# Altium project Air724UG_Reference Design_V1.0(PADS9.5).PrjPcb (part 2 of 3)

## Sheet SIM.SchDoc: Air724UG 参考设计
size 594 x 419 mm; DESIGNER: Loukanghua; REV: V1.0
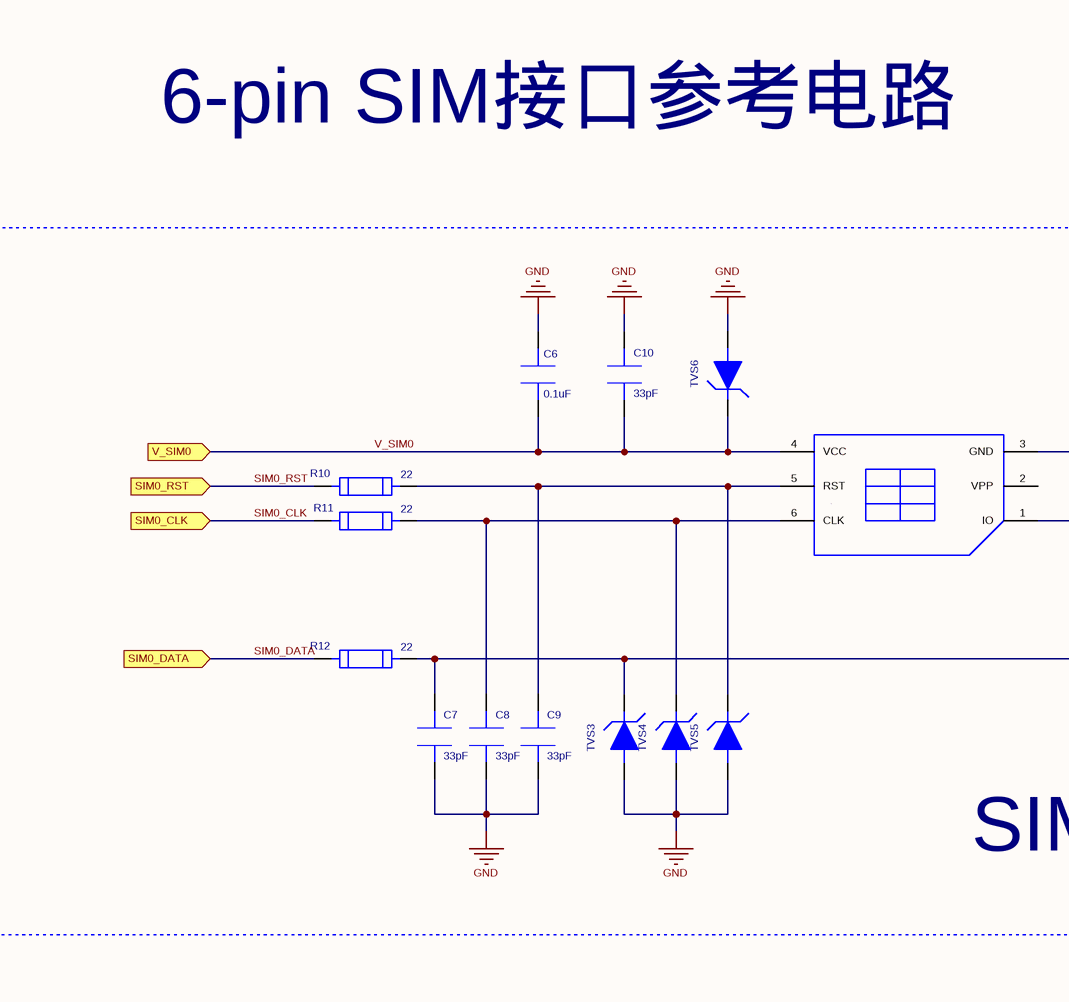
[diagram p23: SIM.SchDoc, top left]
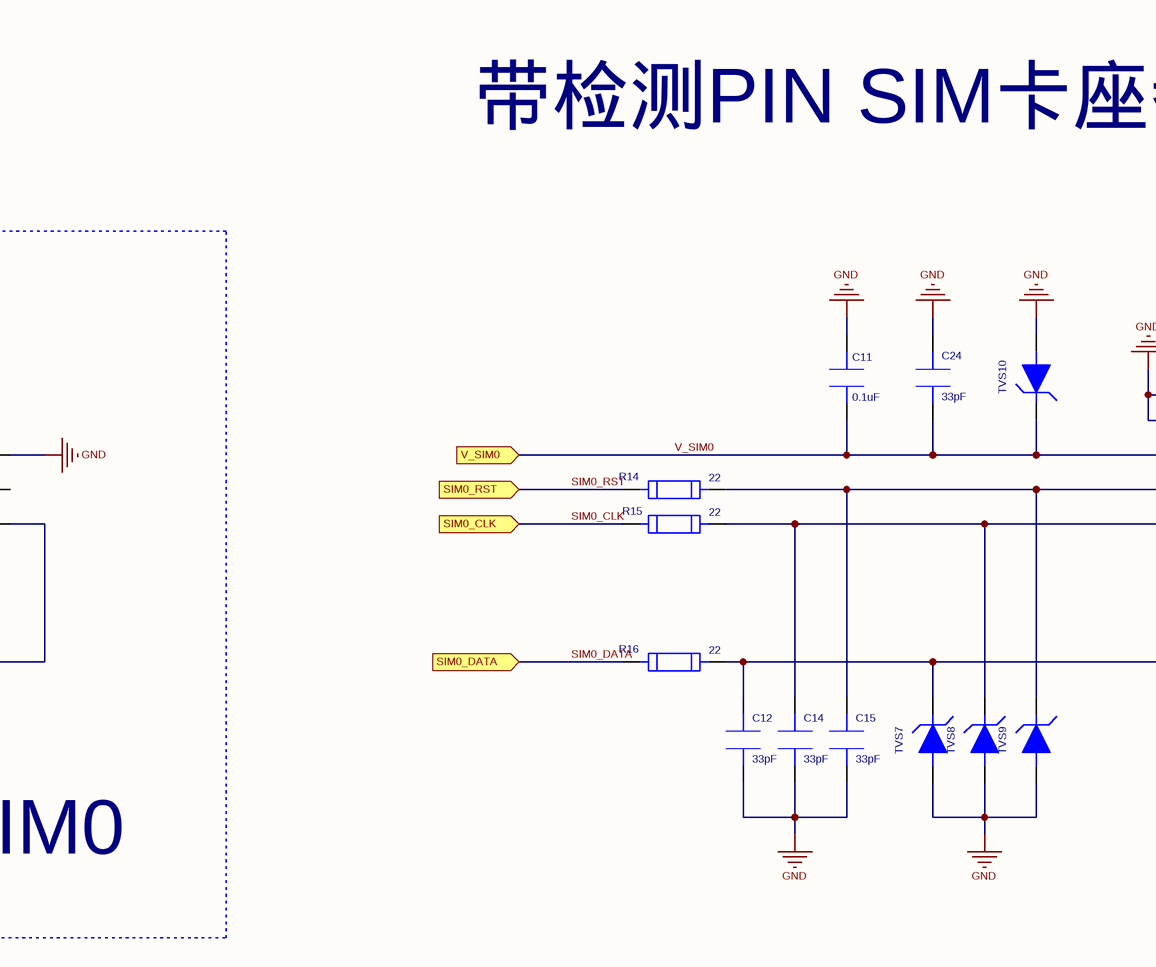
[diagram p24: SIM.SchDoc, top middle]
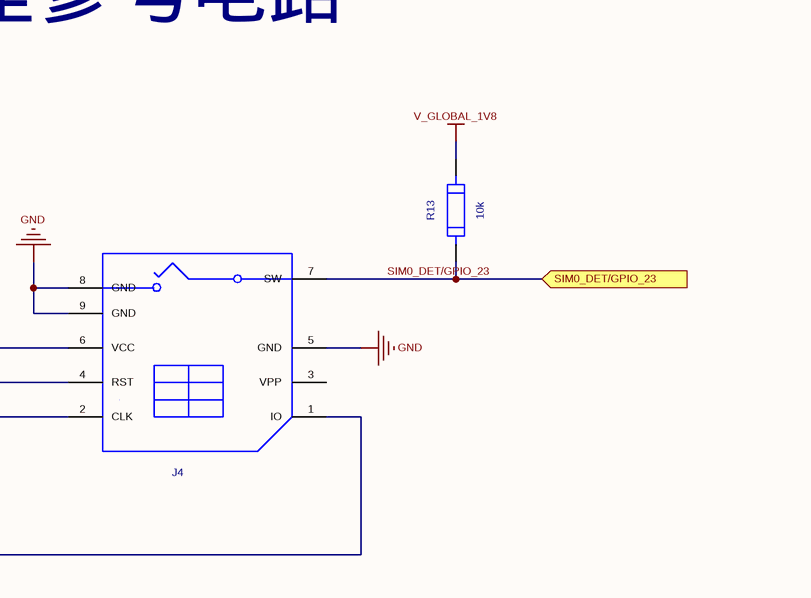
[diagram p25: SIM.SchDoc, top right]
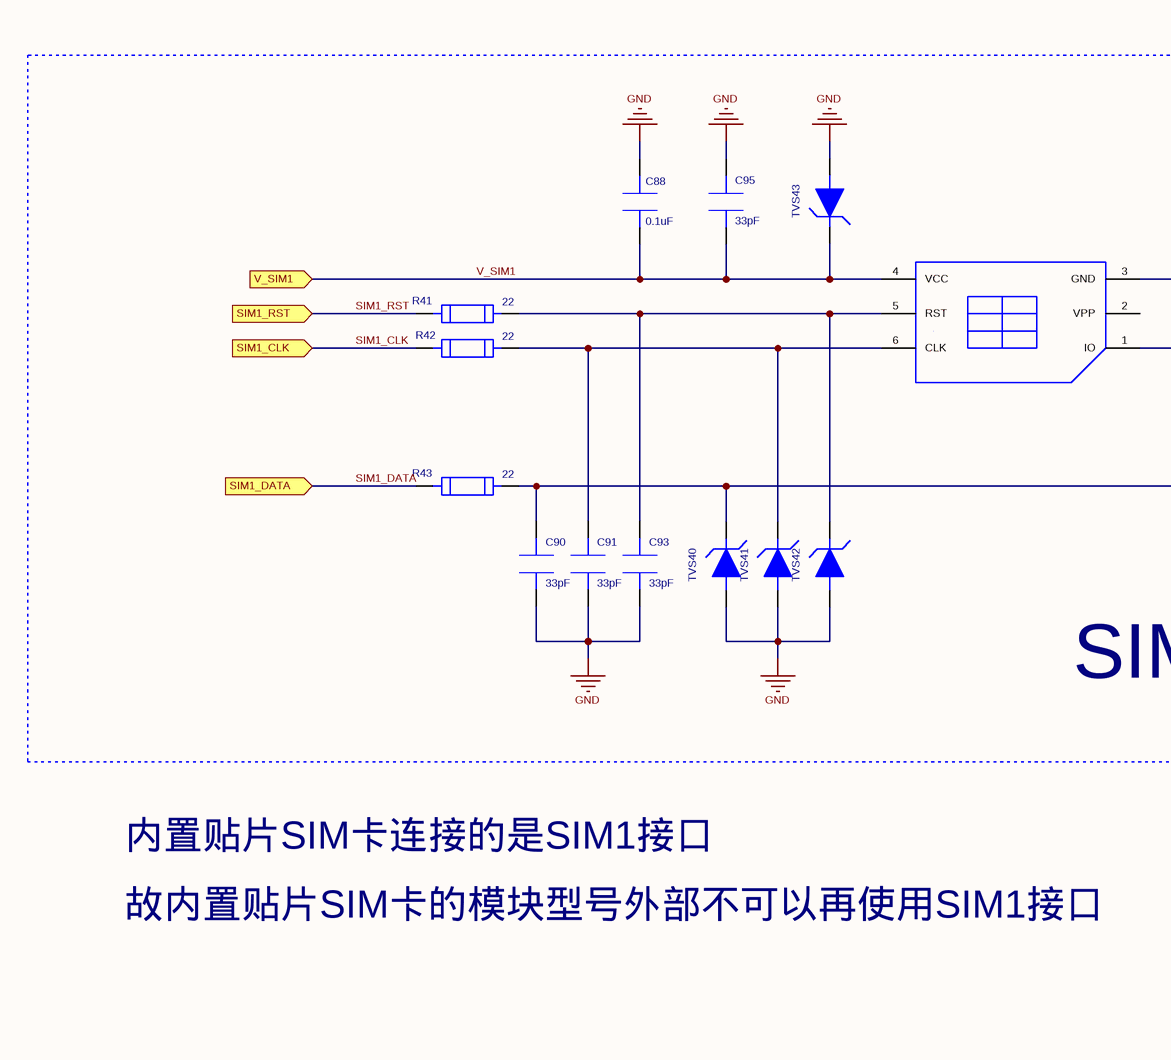
[diagram p26: SIM.SchDoc, bottom left]
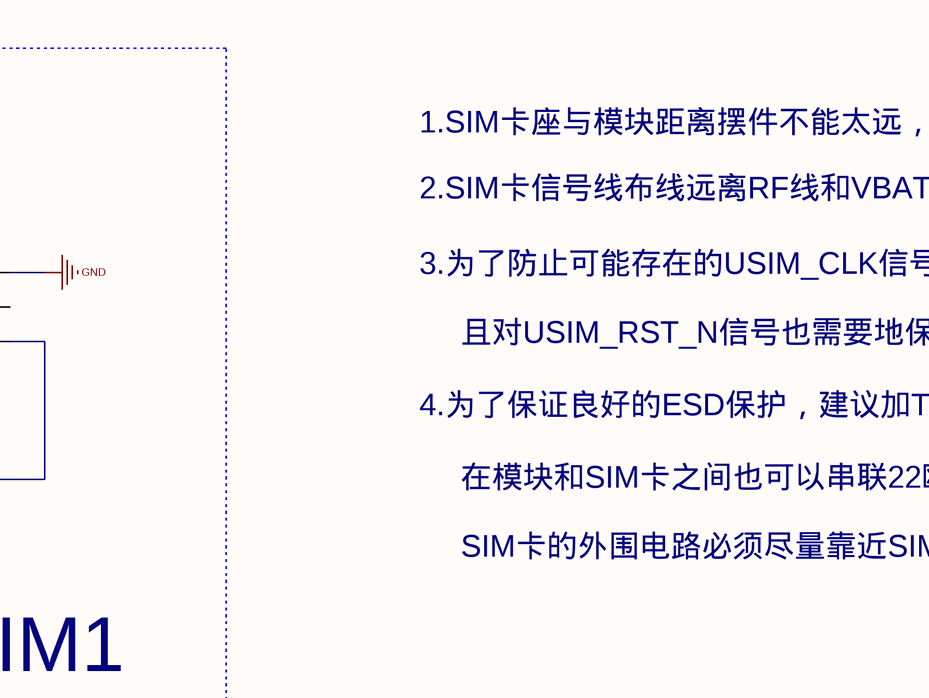
[diagram p27: SIM.SchDoc, bottom middle]
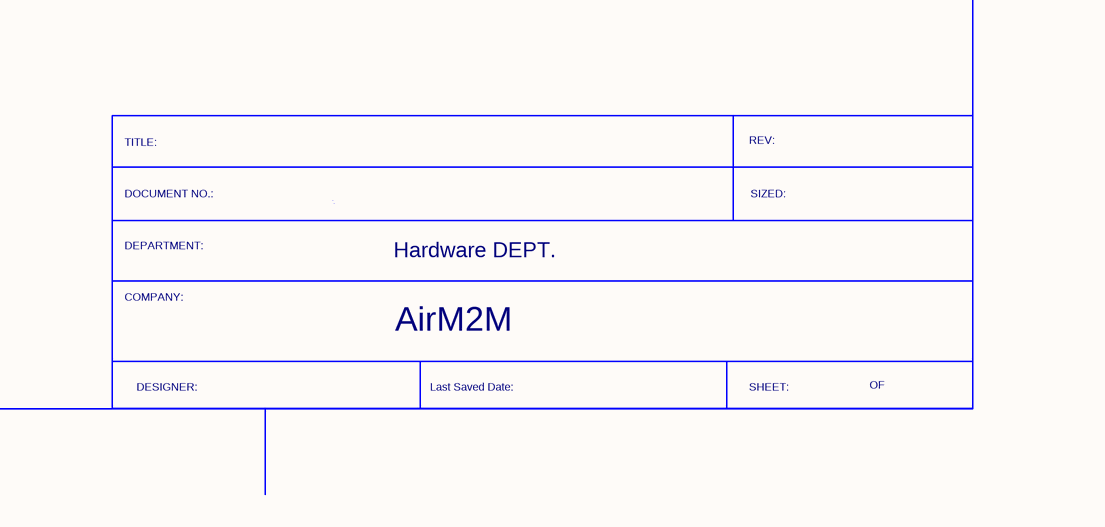
[diagram p28: SIM.SchDoc, bottom right]

### Parts
C6  value 0.1uF  [SC0402]  (hidden comment: CAP-0.1UF-0402-X5R-10V)
C7  value 33pF  [SC0402]  (hidden comment: CAP-33PF-0402-C0G)
C8  value 33pF  [SC0402]  (hidden comment: CAP-33PF-0402-C0G)
C9  value 33pF  [SC0402]  (hidden comment: CAP-33PF-0402-C0G)
C10  value 33pF  [SC0402]  (hidden comment: CAP-33PF-0402-C0G)
C11  value 0.1uF  [SC0402]  (hidden comment: CAP-0.1UF-0402-X5R-10V)
C12  value 33pF  [SC0402]  (hidden comment: CAP-33PF-0402-C0G)
C14  value 33pF  [SC0402]  (hidden comment: CAP-33PF-0402-C0G)
C15  value 33pF  [SC0402]  (hidden comment: CAP-33PF-0402-C0G)
C24  value 33pF  [SC0402]  (hidden comment: CAP-33PF-0402-C0G)
C88  value 0.1uF  [SC0402]  (hidden comment: CAP-0.1UF-0402-X5R-10V)
C90  value 33pF  [SC0402]  (hidden comment: CAP-33PF-0402-C0G)
C91  value 33pF  [SC0402]  (hidden comment: CAP-33PF-0402-C0G)
C93  value 33pF  [SC0402]  (hidden comment: CAP-33PF-0402-C0G)
C95  value 33pF  [SC0402]  (hidden comment: CAP-33PF-0402-C0G)
J2  SIMCARD6_1  [SIMCARD6]  (value not drawn)
J4  SIM-SW-CAF98-06206-XX00  [SIM-SW-CAF98-06206-XX00]  (value not drawn)
J10  SIMCARD6_1  [SIMCARD6]  (value not drawn)
R10  value 22  [SR0402]  (hidden comment: RES-22-0402)
R11  value 22  [SR0402]  (hidden comment: RES-22-0402)
R12  value 22  [SR0402]  (hidden comment: RES-22-0402)
R13  value 10k  [SR0402]  (hidden comment: RES-10K-0402)
R14  value 22  [SR0402]  (hidden comment: RES-22-0402)
R15  value 22  [SR0402]  (hidden comment: RES-22-0402)
R16  value 22  [SR0402]  (hidden comment: RES-22-0402)
R41  value 22  [SR0402]  (hidden comment: RES-22-0402)
R42  value 22  [SR0402]  (hidden comment: RES-22-0402)
R43  value 22  [SR0402]  (hidden comment: RES-22-0402)
TVS3  ESD-TVS-ESD9X5.0ST5G  [SOD-923-ESD9X5.0ST5G]  (value not drawn)
TVS4  ESD-TVS-ESD9X5.0ST5G  [SOD-923-ESD9X5.0ST5G]  (value not drawn)
TVS5  ESD-TVS-ESD9X5.0ST5G  [SOD-923-ESD9X5.0ST5G]  (value not drawn)
TVS6  ESD-TVS-ESD9X5.0ST5G  [SOD-923-ESD9X5.0ST5G]  (value not drawn)
TVS7  ESD-TVS-ESD9X5.0ST5G  [SOD-923-ESD9X5.0ST5G]  (value not drawn)
TVS8  ESD-TVS-ESD9X5.0ST5G  [SOD-923-ESD9X5.0ST5G]  (value not drawn)
TVS9  ESD-TVS-ESD9X5.0ST5G  [SOD-923-ESD9X5.0ST5G]  (value not drawn)
TVS10  ESD-TVS-ESD9X5.0ST5G  [SOD-923-ESD9X5.0ST5G]  (value not drawn)
TVS40  ESD-TVS-ESD9X5.0ST5G  [SOD-923-ESD9X5.0ST5G]  (value not drawn)
TVS41  ESD-TVS-ESD9X5.0ST5G  [SOD-923-ESD9X5.0ST5G]  (value not drawn)
TVS42  ESD-TVS-ESD9X5.0ST5G  [SOD-923-ESD9X5.0ST5G]  (value not drawn)
TVS43  ESD-TVS-ESD9X5.0ST5G  [SOD-923-ESD9X5.0ST5G]  (value not drawn)

### Blocks framed on the sheet
SIM0: C6-C10 J2 R10-R12 TVS3-TVS6
SIM1: C88 C90 C91 C93 C95 J10 R41-R43 TVS40-TVS43

### Ports
SIM0_CLK, SIM0_DATA, SIM0_DET/GPIO_23, SIM0_RST, SIM1_CLK, SIM1_DATA, SIM1_RST, V_SIM0, V_SIM1

### Nets
GND: C6.2 C7.2 C8.2 C9.2 C10.1 C11.2 C12.2 C14.2 C15.2 C24.1 C88.2 C90.2 C91.2 C93.2 C95.1 J2.3(GND) J4.5(GND) J4.8(GND) J4.9(GND) J10.3(GND) TVS3.2 TVS4.2 TVS5.2 TVS6.2 TVS7.2 TVS8.2 TVS9.2 TVS10.2 TVS40.2 TVS41.2 TVS42.2 TVS43.2
V_GLOBAL_1V8: R13.2
SIM0_CLK: R11.1 R15.1 ; port SIM0_CLK
SIM0_DATA: R12.1 R16.1 ; port SIM0_DATA
SIM0_DET/GPIO_23: J4.7(SW) R13.1 ; port SIM0_DET/GPIO_23
SIM0_RST: R10.1 R14.1 ; port SIM0_RST
SIM1_CLK: R42.1 ; port SIM1_CLK
SIM1_DATA: R43.1 ; port SIM1_DATA
SIM1_RST: R41.1 ; port SIM1_RST
V_SIM0: C6.1 C10.2 C11.1 C24.2 J2.4(VCC) J4.6(VCC) TVS6.1 TVS10.1 ; port V_SIM0
V_SIM1: C88.1 C95.2 J10.4(VCC) TVS43.1 ; port V_SIM1
NetC7_1: C7.1 J2.1(IO) R12.2 TVS3.1
NetC8_1: C8.1 J2.6(CLK) R11.2 TVS4.1
NetC9_1: C9.1 J2.5(RST) R10.2 TVS5.1
NetC12_1: C12.1 J4.1(IO) R16.2 TVS7.1
NetC14_1: C14.1 J4.2(CLK) R15.2 TVS8.1
NetC15_1: C15.1 J4.4(RST) R14.2 TVS9.1
NetC90_1: C90.1 J10.1(IO) R43.2 TVS40.1
NetC91_1: C91.1 J10.6(CLK) R42.2 TVS41.1
NetC93_1: C93.1 J10.5(RST) R41.2 TVS42.1

Not connected (* = marked no-connect by the designer): J2 2(VPP); J4 3(VPP); J10 2(VPP)

### Notes on the sheet
- 6-pin SIM接口参考电路
- 带检测PIN SIM卡座参考电路
- 1.SIM卡座与模块距离摆件不能太远，越近越好，尽量保证SIM卡信号线布线不超过20cm；
- 2.SIM卡信号线布线远离RF线和VBAT电源线；
- 3.为了防止可能存在的USIM_CLK信号对USIM_DATA信号的串扰，两者布线不要太靠近，在两条走线之间增加地屏蔽。
- 且对USIM_RST_N信号也需要地保护;
- 4.为了保证良好的ESD保护，建议加TVS管，并靠近SIM卡座摆放。选择的ESD器件寄生电容不大于50pF。
- 在模块和SIM卡之间也可以串联22欧姆的电阻用以抑制杂散EMI，增强ESD防护。
- SIM卡的外围电路必须尽量靠近SIM卡座。
- 内置贴片SIM卡连接的是SIM1接口
- 故内置贴片SIM卡的模块型号外部不可以再使用SIM1接口
- TITLE:
- REV:
- DEPARTMENT:
- DOCUMENT NO.:
- Hardware DEPT.
- SIZED:
- COMPANY:
- AirM2M
- DESIGNER:
- Last Saved Date:
- SHEET:
- OF

### Library data of the parts
C6 C11 C88 = CAP-0.1UF-0402-X5R-10V: CAP CER X5R/X7R;0.1uF;+/-10%;10V;0402;0.5mm;ROHS; Manufacture 1: Murata;Yageo;Walsin;Eyang; Manufacture 1 P/N: GRM155R61A104K****;GRM155R71A104K****;CC0402KRX5R6BB104;0402X104K100CT;C0402X5R104K100N*; Geometry.Height: 0.55mm; Serial Number: 80214720001; Tolerance: +/-10%; PCB DECAL: SC0402
C7-C10 C12 C14 C15 C24 C90 C91 C93 C95 = CAP-33PF-0402-C0G: CAP CER C0G;33PF;+/-5%;50V;0402;0.5mm;ROHS; Manufacture 1: MURATA;Yageo;Eyang; Manufacture 1 P/N: GRM1555C1H330J****;CC0402JRNPO9BN330;C0402C0G330J500N*; Geometry.Height: 0.55mm; Serial Number: 80214650008; Tolerance: +/-5%; PCB DECAL: SC0402
J2 J10 = SIMCARD6_1: SIM?座;6PIN;17.70*8.30*3.60mm;ROHS; Manufacture 1: 皇泽;; Manufacture 1 P/N: SIMWH-03605-TP00; Serial Number: 81300000026; Geometry.Height: 3.6mm; PCB DECAL: SIMCARD6
J4 = SIM-SW-CAF98-06206-XX00: SIM卡座;8PIN;PUSH TO PUSH;26.6*19.1*2.1mm;ROHS; Manufacture 1 P/N: CAF98-06206-S100; Manufacture 1: 乾德电子(Linkconn);; Geometry.Height: 2.1mm; Serial Number: 81330000088; PCB DECAL: SIM-SW-CAF98-06206-XX00
R10-R12 R14-R16 R41-R43 = RES-22-0402: RES FILM;22;+/-5%;1/16W;0402;0.4mm;ROHS; Manufacture 1 P/N: RC0402JR-0722RL; Manufacture 1: YAGEO; Serial Number: 80114640035; Geometry.Height: 0.4mm; Tolerance: +/-5%; PCB DECAL: SR0402
R13 = RES-10K-0402: RES FILM;10K;+/-5%;1/16W;0402;0.4mm;ROHS; Manufacture 1 P/N: RC0402JR-0710KL;WR04X103_JTL; Manufacture 1: YAGEO;Walsin; Serial Number: 80114640004; Geometry.Height: 0.4mm; Tolerance: +/-5%; PCB DECAL: SR0402
TVS3-TVS10 TVS40-TVS43 = ESD-TVS-ESD9X5.0ST5G: TVS;5.0V;65PF;SOD?923;ROHS; Manufacture 1: ONSEMI; Geometry.Height: 0.43mm; Serial Number: 81121000001; Manufacture 1 P/N: ESD9X5.0ST5G; PCB DECAL: SOD-923-ESD9X5.0ST5G

## Sheet T-FLASH.SchDoc: Air724UG 参考设计
size 594 x 419 mm; DESIGNER: Loukanghua; REV: V1.0
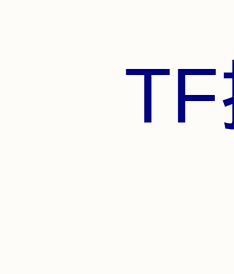
[diagram p29: T-FLASH.SchDoc, top left]
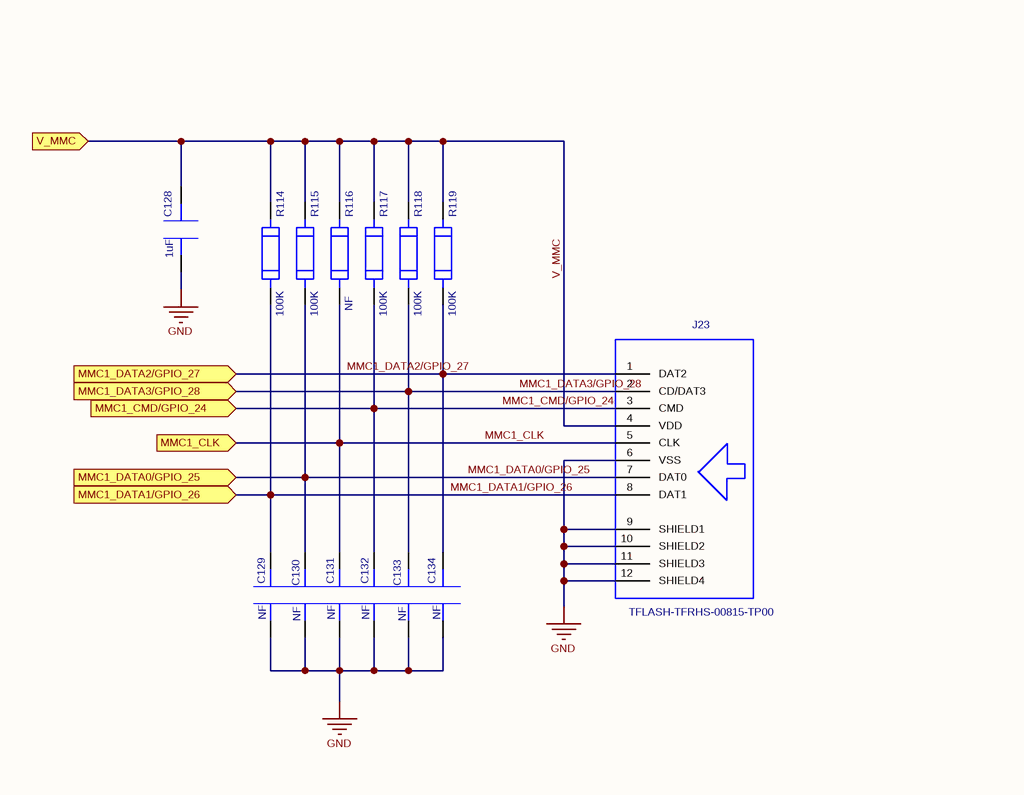
[diagram p30: T-FLASH.SchDoc, top middle]
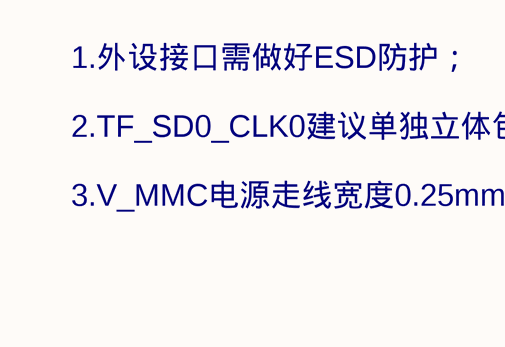
[diagram p31: T-FLASH.SchDoc, bottom middle]
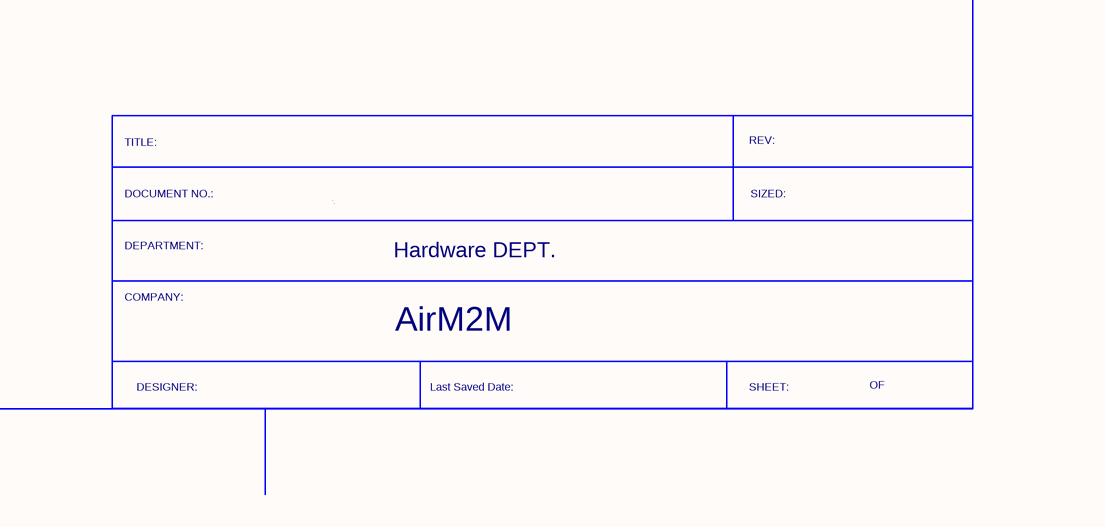
[diagram p32: T-FLASH.SchDoc, bottom right]

### Parts
C128  value 1uF  [SC0402]  (hidden comment: CAP-1UF-0402-X5R)
C129  value NF  [SC0402-NF]  (hidden comment: CAP-0402-NF)
C130  value NF  [SC0402-NF]  (hidden comment: CAP-0402-NF)
C131  value NF  [SC0402-NF]  (hidden comment: CAP-0402-NF)
C132  value NF  [SC0402-NF]  (hidden comment: CAP-0402-NF)
C133  value NF  [SC0402-NF]  (hidden comment: CAP-0402-NF)
C134  value NF  [SC0402-NF]  (hidden comment: CAP-0402-NF)
J23  TFLASH-TFRHS-00815-TP00  [TFLASH-TFRHS-00815-TP00]
R114  value 100K  [SR0402]  (hidden comment: RES-100K-0402)
R115  value 100K  [SR0402]  (hidden comment: RES-100K-0402)
R116  value NF  [SR0402-NF]  (hidden comment: RES-0402-NF)
R117  value 100K  [SR0402]  (hidden comment: RES-100K-0402)
R118  value 100K  [SR0402]  (hidden comment: RES-100K-0402)
R119  value 100K  [SR0402]  (hidden comment: RES-100K-0402)

### Ports
MMC1_CLK, MMC1_CMD/GPIO_24, MMC1_DATA0/GPIO_25, MMC1_DATA1/GPIO_26, MMC1_DATA2/GPIO_27, MMC1_DATA3/GPIO_28, V_MMC

### Nets
GND: C128.2 C129.2 C130.2 C131.2 C132.2 C133.2 C134.2 J23.6(VSS) J23.9(SHIELD1) J23.10(SHIELD2) J23.11(SHIELD3) J23.12(SHIELD4)
MMC1_CLK: C131.1 J23.5(CLK) R116.1 ; port MMC1_CLK
MMC1_CMD/GPIO_24: C132.1 J23.3(CMD) R117.1 ; port MMC1_CMD/GPIO_24
MMC1_DATA0/GPIO_25: C130.1 J23.7(DAT0) R115.1 ; port MMC1_DATA0/GPIO_25
MMC1_DATA1/GPIO_26: C129.1 J23.8(DAT1) R114.1 ; port MMC1_DATA1/GPIO_26
MMC1_DATA2/GPIO_27: C134.1 J23.1(DAT2) R119.1 ; port MMC1_DATA2/GPIO_27
MMC1_DATA3/GPIO_28: C133.1 J23.2(CD/DAT3) R118.1 ; port MMC1_DATA3/GPIO_28
V_MMC: C128.1 J23.4(VDD) R114.2 R115.2 R116.2 R117.2 R118.2 R119.2 ; port V_MMC

### Notes on the sheet
- TF接口参考电路
- 1.外设接口需做好ESD防护；
- 2.TF_SD0_CLK0建议单独立体包地，其他信号线整组一起同层包地；
- 3.V_MMC电源走线宽度0.25mm以上。
- TITLE:
- REV:
- DEPARTMENT:
- DOCUMENT NO.:
- Hardware DEPT.
- SIZED:
- COMPANY:
- AirM2M
- DESIGNER:
- Last Saved Date:
- SHEET:
- OF

### Library data of the parts
C128 = CAP-1UF-0402-X5R: CAP CER X5R;1uF;+/-10%;6.3V;0402;0.5mm;ROHS; Manufacture 1 P/N: GRM155R60J105K****;CC0402KRX5R5BB105;C1005X5R0J105KT;JMK105BJ105KV-F;ECJ0EB0J105K;0402X105K6R3CT;CL05A105KQ5NNNC; Manufacture 1: Murata;Yageo;TDK;Taiyo Yuden;Panasonic;Walsin;Samsung; Serial Number: 80214710001; Geometry.Height: 0.55mm; Tolerance: +/-10%; PCB DECAL: SC0402
C129-C134 = CAP-0402-NF: NF; Geometry.Height: 0.55mm; Manufacture 1: NF; Manufacture 1 P/N: NF; Serial Number: NF; PCB DECAL: SC0402-NF
J23 = TFLASH-TFRHS-00815-TP00: T-FLASH卡座;8PIN;掀盖式;13.6*14.5*1.95mm;ROHS; Manufacture 1 P/N: CAH11-08193-SF01;TFRHS-00815-TP00;TFRHS-00815-XX00;AC0200-020;TF0108322-R;SG-TFS-0001; Manufacture 1: 乾德电子;皇泽;上海徕木;精塑;Singeen(星擎)();; serial number: TF0108522-R; Geometry.Height: 1.95mm; PCB DECAL: TFLASH-TFRHS-00815-TP00
R114 R115 R117-R119 = RES-100K-0402: RES FILM;100K;+/-5%;1/16W;0402;0.4mm;ROHS; Manufacture 1: YAGEO;Walsin; Manufacture 1 P/N: RC0402JR-07100KL;WR04X104_JTL;; Geometry.Height: 0.40mm; Serial Number: 80114640005; Tolerance: +/-5%; PCB DECAL: SR0402
R116 = RES-0402-NF: NF; Geometry.Height: 0.4mm; Tolerance: +/-5%; Serial Number: NF; Manufacture 1: NF; Manufacture 1 P/N: NF; PCB DECAL: SR0402-NF

## Sheet CAMERA.SchDoc: Air724UG 参考设计
size 594 x 419 mm; DESIGNER: Loukanghua; REV: V1.0
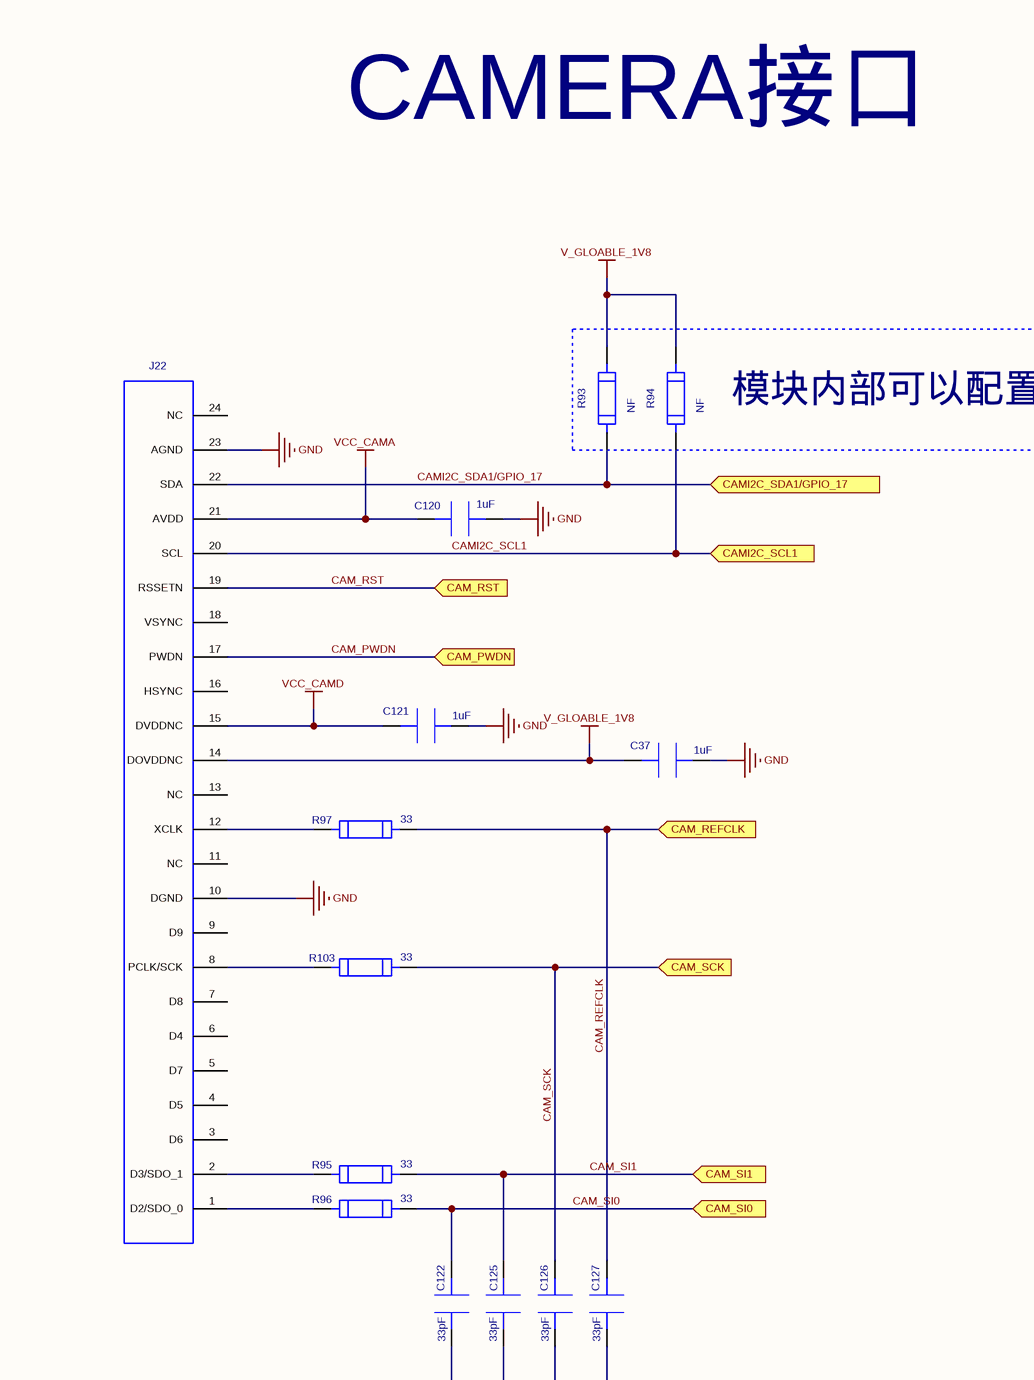
[diagram p33: CAMERA.SchDoc, top left]
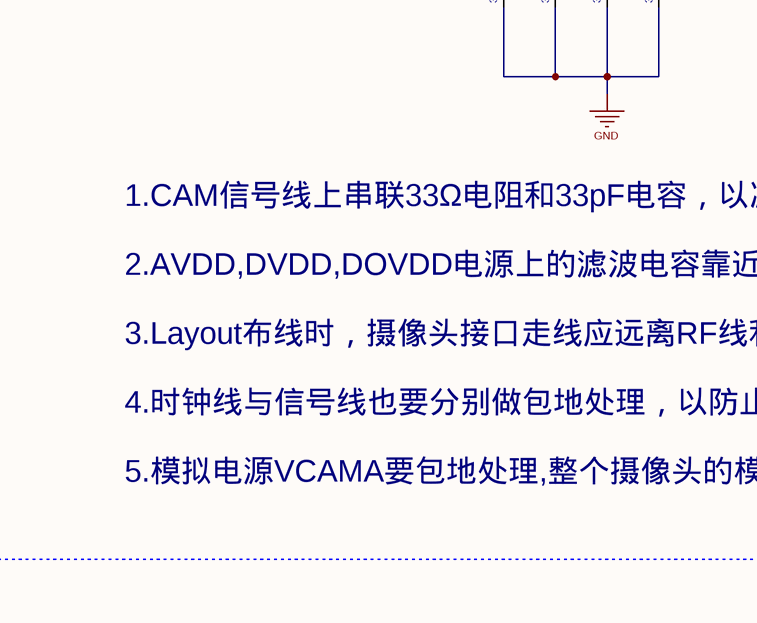
[diagram p34: CAMERA.SchDoc, bottom left]
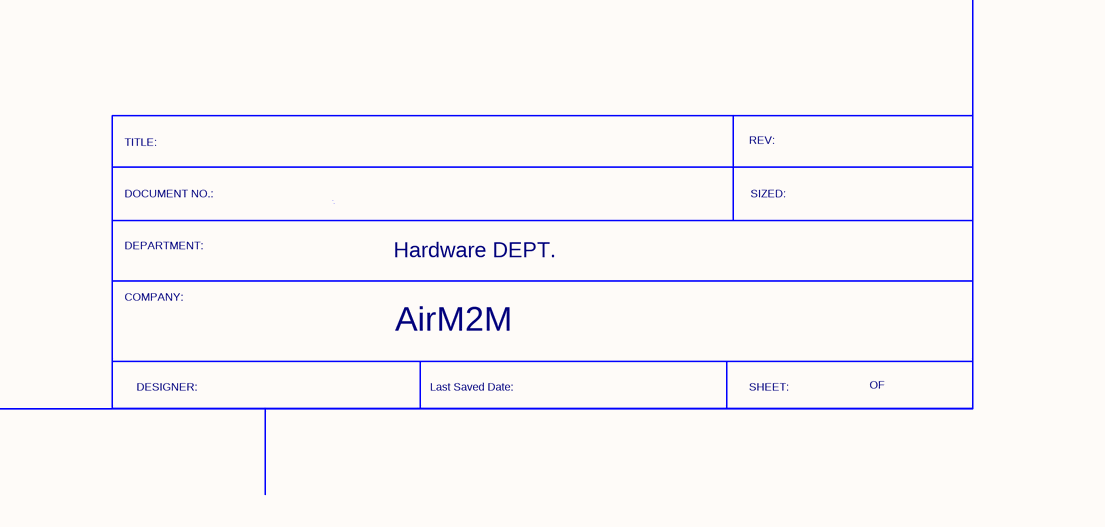
[diagram p35: CAMERA.SchDoc, bottom right]

### Parts
C37  value 1uF  [SC0402]  (hidden comment: CAP-1UF-0402-X5R)
C120  value 1uF  [SC0402]  (hidden comment: CAP-1UF-0402-X5R)
C121  value 1uF  [SC0402]  (hidden comment: CAP-1UF-0402-X5R)
C122  value 33pF  [SC0402]  (hidden comment: CAP-33PF-0402-C0G)
C125  value 33pF  [SC0402]  (hidden comment: CAP-33PF-0402-C0G)
C126  value 33pF  [SC0402]  (hidden comment: CAP-33PF-0402-C0G)
C127  value 33pF  [SC0402]  (hidden comment: CAP-33PF-0402-C0G)
J22  FPC-24PIN-0.5MM-Y  [FPC-24PIN-0.5MM]  (value not drawn)
R93  value NF  [SR0402-NF]  (hidden comment: RES-0402-NF)
R94  value NF  [SR0402-NF]  (hidden comment: RES-0402-NF)
R95  value 33  [SR0402]  (hidden comment: RES-22-0402)
R96  value 33  [SR0402]  (hidden comment: RES-22-0402)
R97  value 33  [SR0402]  (hidden comment: RES-22-0402)
R103  value 33  [SR0402]  (hidden comment: RES-22-0402)

### Blocks framed on the sheet
CAMERA接口: C37 C120-C122 C125-C127 J22 R95-R97 R103
模块内部可以配置I2C 上拉，外部可以不贴: R93 R94

### Ports
CAM_PWDN, CAM_REFCLK, CAM_RST, CAM_SCK, CAM_SI0, CAM_SI1, CAMI2C_SCL1, CAMI2C_SDA1/GPIO_17

### Nets
GND: C37.2 C120.1 C121.2 C122.1 C125.1 C126.1 C127.1 J22.10(DGND) J22.23(AGND) J22.25(GND) J22.26(GND)
V_GLOABLE_1V8: C37.1 J22.14(DOVDDNC) R93.2 R94.2
VCC_CAMA: C120.2 J22.21(AVDD)
VCC_CAMD: C121.1 J22.15(DVDDNC)
CAM_PWDN: J22.17(PWDN) ; port CAM_PWDN
CAM_REFCLK: C127.2 R97.2 ; port CAM_REFCLK
CAM_RST: J22.19(RSSETN) ; port CAM_RST
CAM_SCK: C126.2 R103.2 ; port CAM_SCK
CAM_SI0: C122.2 R96.2 ; port CAM_SI0
CAM_SI1: C125.2 R95.2 ; port CAM_SI1
CAMI2C_SCL1: J22.20(SCL) R94.1 ; port CAMI2C_SCL1
CAMI2C_SDA1/GPIO_17: J22.22(SDA) R93.1 ; port CAMI2C_SDA1/GPIO_17
NetJ22_1: J22.1(D2/SDO_0) R96.1
NetJ22_2: J22.2(D3/SDO_1) R95.1
NetJ22_8: J22.8(PCLK/SCK) R103.1
NetJ22_12: J22.12(XCLK) R97.1

Not connected (* = marked no-connect by the designer): J22 3(D6) 4(D5) 5(D7) 6(D4) 7(D8) 9(D9) 11(NC) 13(NC) 16(HSYNC) 18(VSYNC) 24(NC)

### Notes on the sheet
- 1.CAM信号线上串联33Ω电阻和33pF电容，以减小射频干扰。
- 2.AVDD,DVDD,DOVDD电源上的滤波电容靠近连接器端摆放。
- 3.Layout布线时，摄像头接口走线应远离RF线和VBAT电源线，尤其是时钟线与信号线。
- 4.时钟线与信号线也要分别做包地处理，以防止干扰。
- 5.模拟电源VCAMA要包地处理,整个摄像头的模拟部分是由VCAMA供电。
- TITLE:
- REV:
- DEPARTMENT:
- DOCUMENT NO.:
- Hardware DEPT.
- SIZED:
- COMPANY:
- AirM2M
- DESIGNER:
- Last Saved Date:
- SHEET:
- OF

### Library data of the parts
C37 C120 C121 = CAP-1UF-0402-X5R: as C128 on sheet T-FLASH; Tolerance: +/-10%; PCB DECAL: SC0402
C122 C125-C127 = CAP-33PF-0402-C0G: as C7-C10 on sheet SIM; Tolerance: +/-5%; PCB DECAL: SC0402
J22 = FPC-24PIN-0.5MM-Y: Geometry.Height: 2.0mm; PCB DECAL: FPC-24PIN-0.5MM
R93 R94 = RES-0402-NF: as R116 on sheet T-FLASH; Serial Number: NF; Manufacture 1 P/N: NF; Manufacture 1: NF; PCB DECAL: SR0402-NF
R95-R97 R103 = RES-22-0402: as R10 on sheet SIM; Geometry.Height: 0.4mm; Tolerance: +/-5%; PCB DECAL: SR0402

## Sheet UART.SchDoc: Air724UG 参考设计
size 594 x 419 mm; DESIGNER: Loukanghua; REV: V1.0
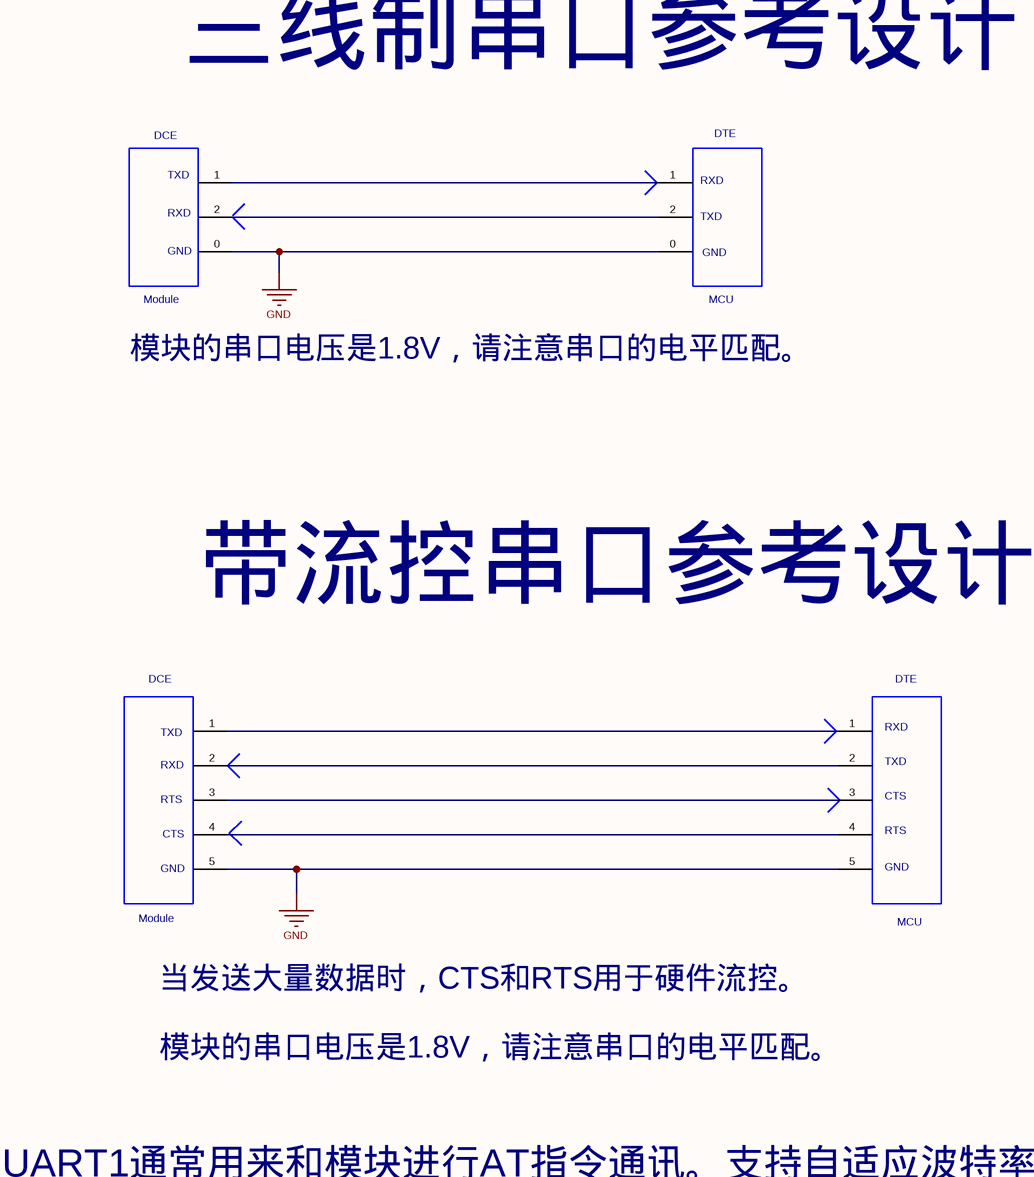
[diagram p36: UART.SchDoc, top left]
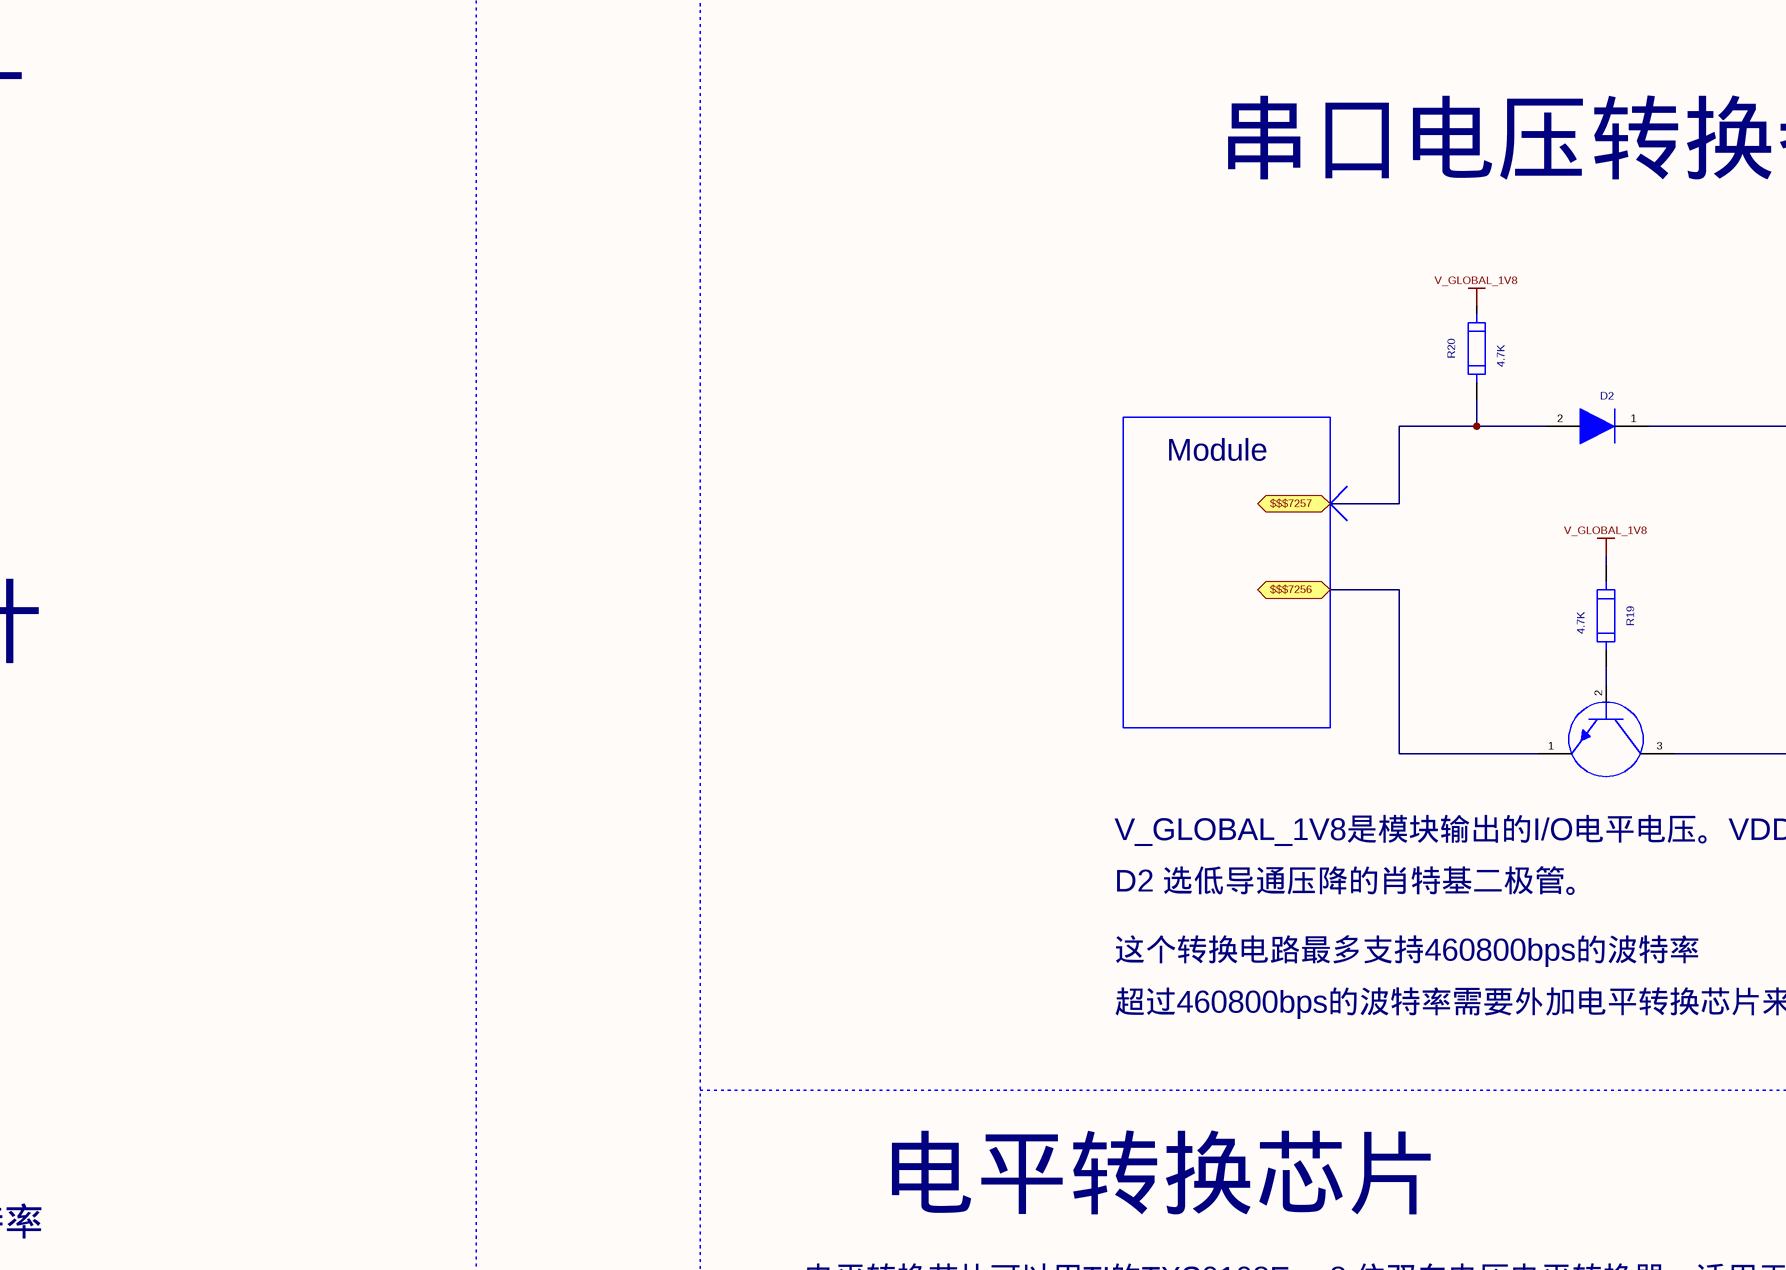
[diagram p37: UART.SchDoc, top middle]
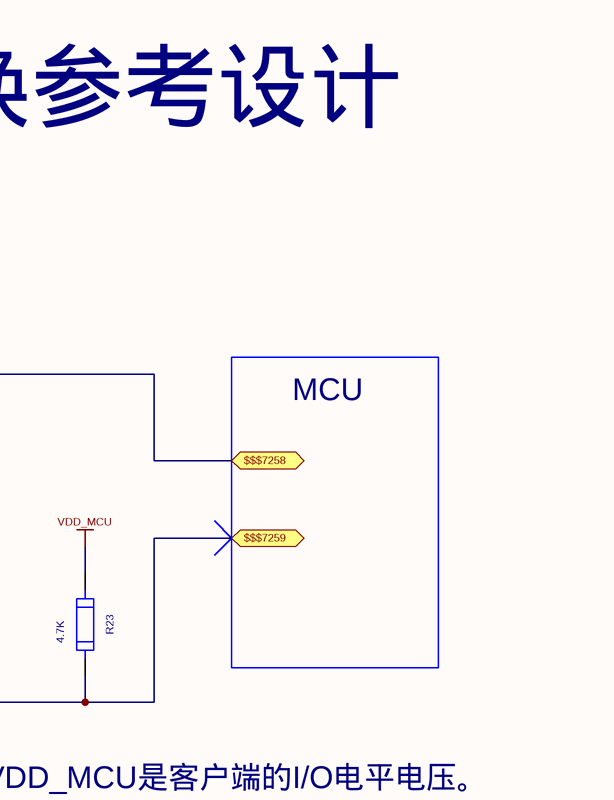
[diagram p38: UART.SchDoc, top right]
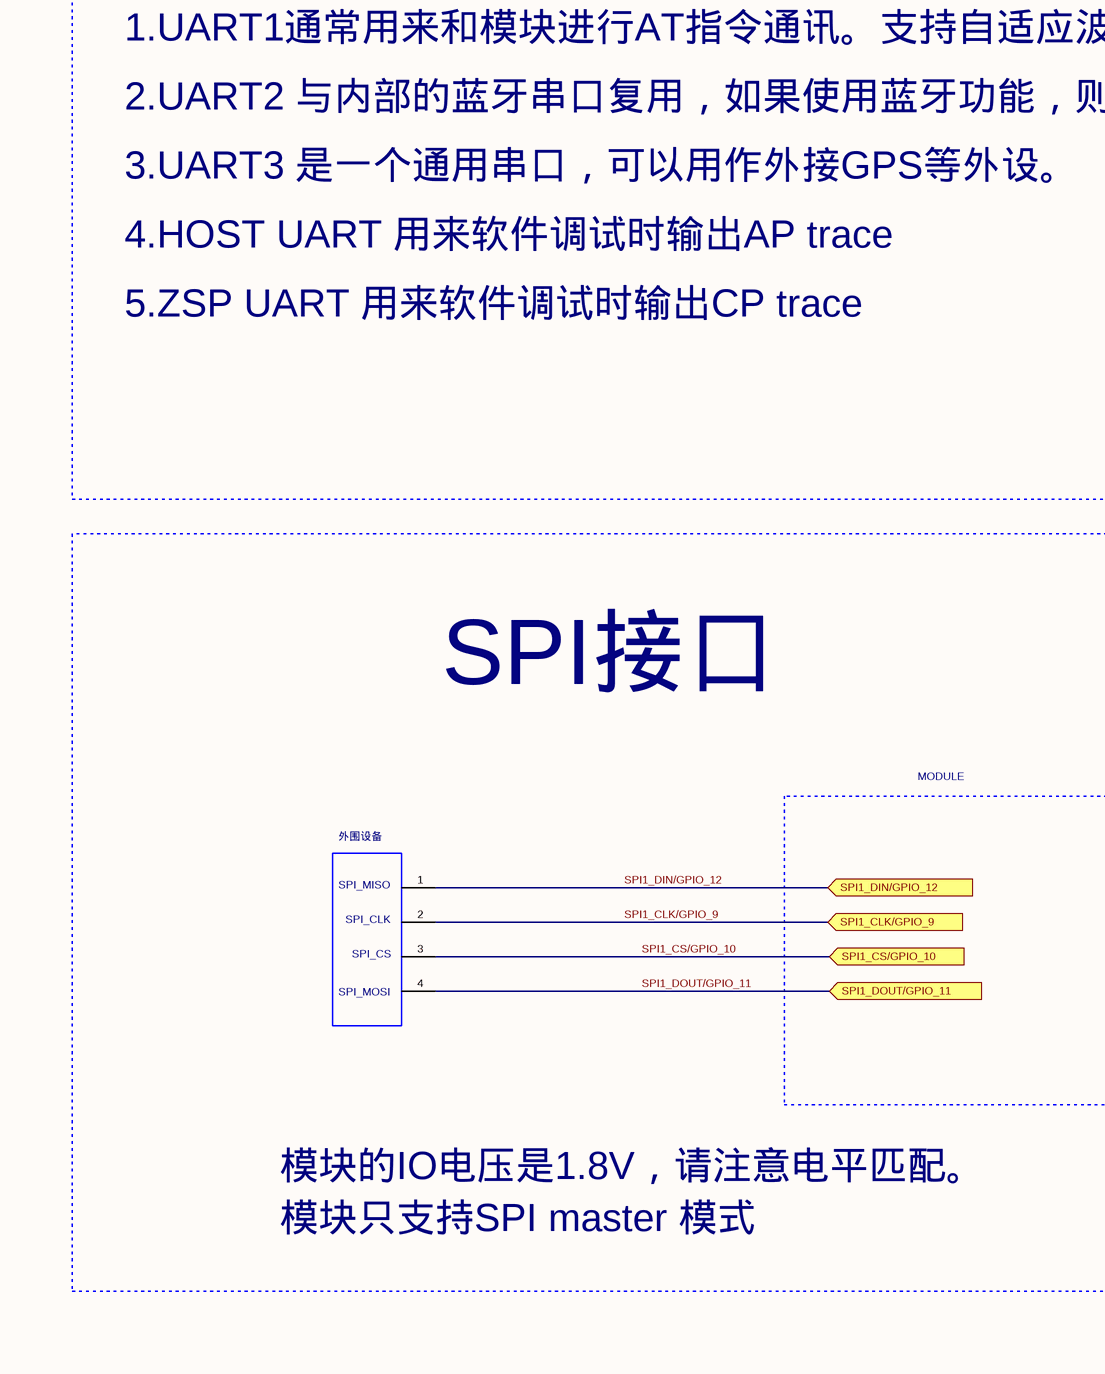
[diagram p39: UART.SchDoc, bottom left]
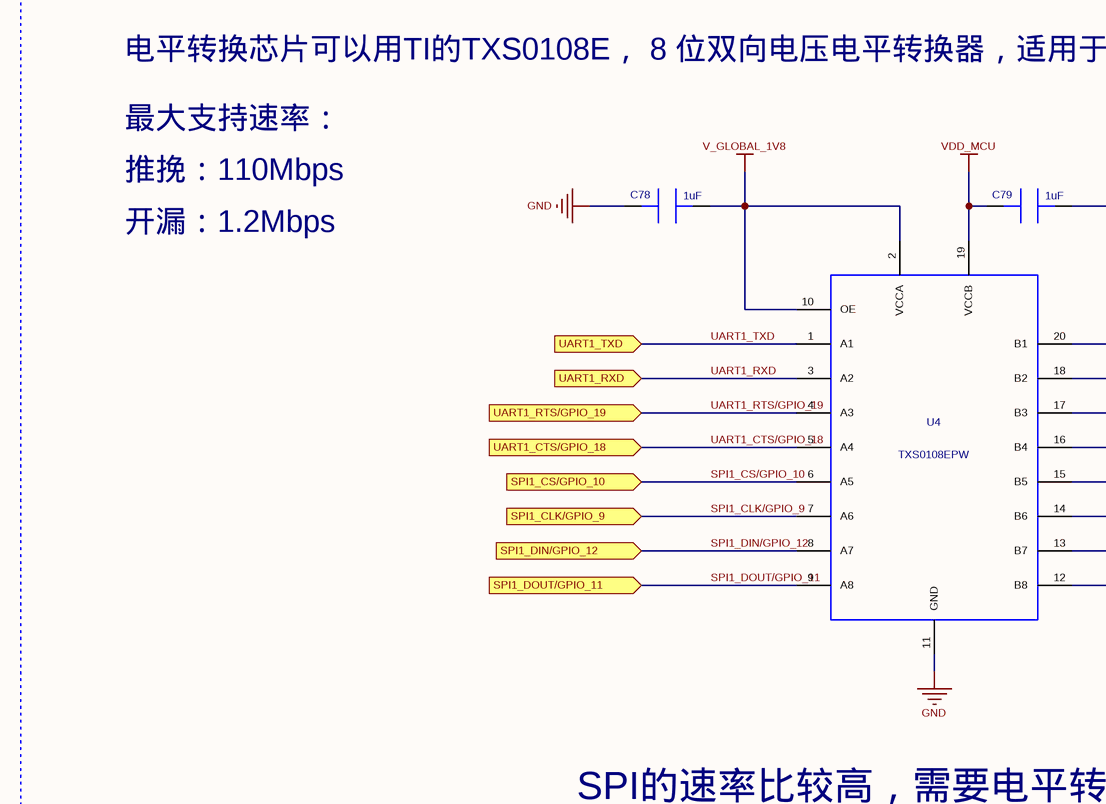
[diagram p40: UART.SchDoc, bottom middle]
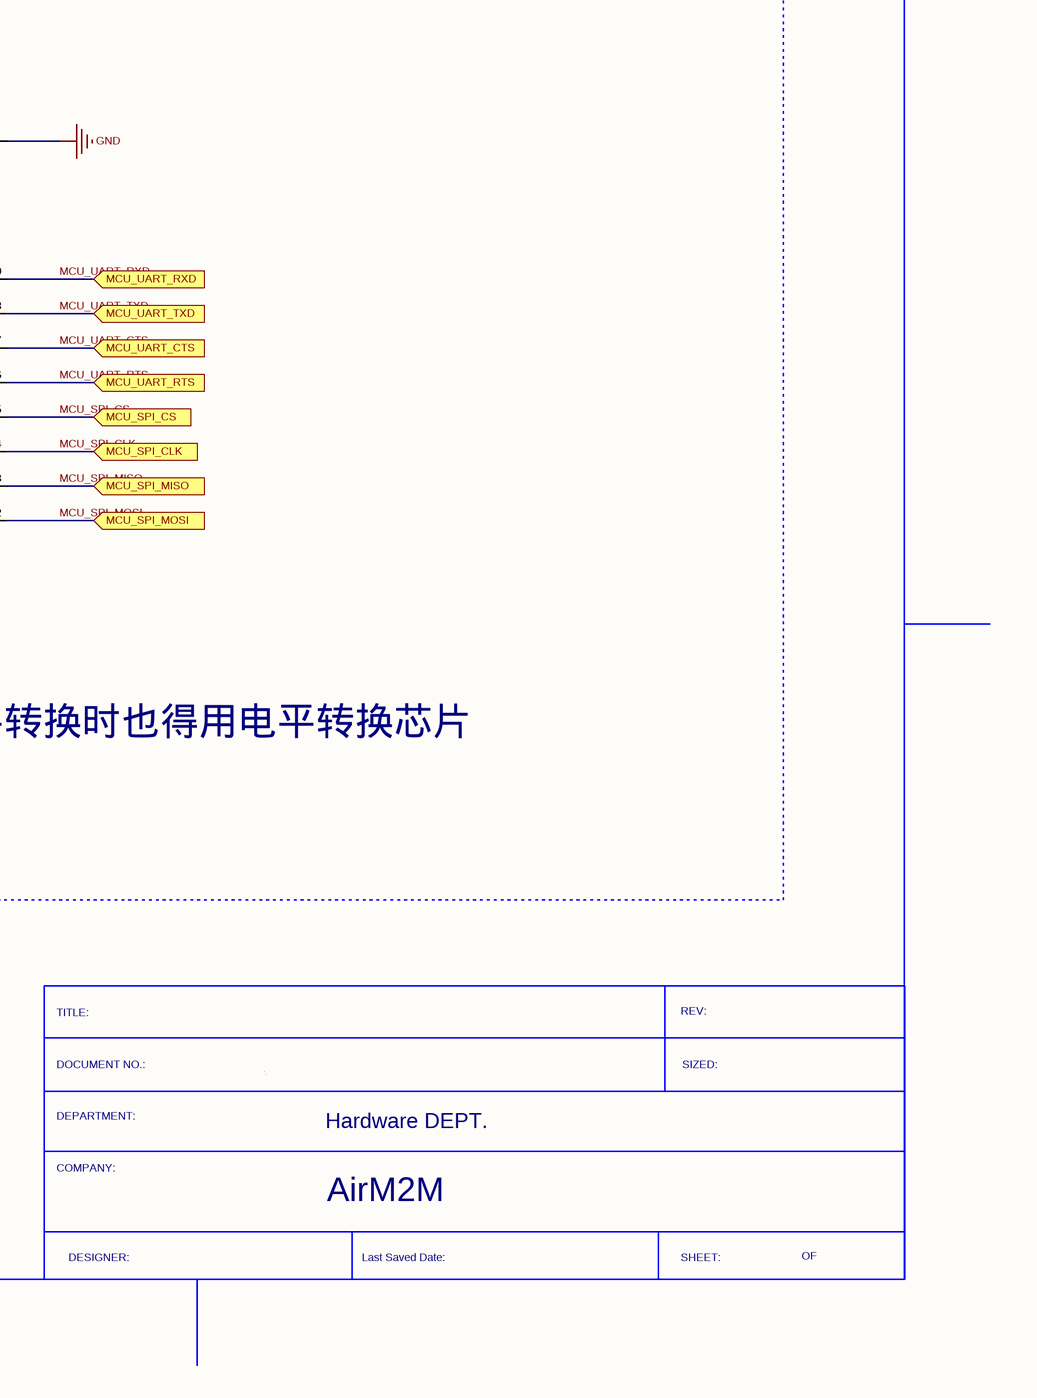
[diagram p41: UART.SchDoc, bottom right]

### Parts
C78  value 1uF  [SC0402]  (hidden comment: CAP-1UF-0402-X5R)
C79  value 1uF  [SC0402]  (hidden comment: CAP-1UF-0402-X5R)
D2  DIODE-SCHOTTKY-RB521S-30  [SOD523(RB521S)]  (value not drawn)
J27  DIP3X1  [DIP2X1-2.54]  (value not drawn)
J28  DIP3X1  [DIP2X1-2.54]  (value not drawn)
J29  DIP5X1  [DIP2X1-2.54]  (value not drawn)
J30  DIP5X1  [DIP2X1-2.54]  (value not drawn)
J33  DIP4X1  [DIP2X1-2.54]  (value not drawn)
Q4  TRIODE-NPN-2SC3356  [3PIN-2SC3356]  (value not drawn)
R19  value 4.7K  [SR0402]  (hidden comment: RES-4.7K-0402)
R20  value 4.7K  [SR0402]  (hidden comment: RES-4.7K-0402)
R23  value 4.7K  [SR0402]  (hidden comment: RES-4.7K-0402)
U4  TXS0108EPW

### Blocks framed on the sheet
SPI接口: J33

### Ports
$$$7256 (bidir), $$$7257 (bidir), $$$7258 (bidir), $$$7259 (bidir), MCU_SPI_CLK, MCU_SPI_CS, MCU_SPI_MISO, MCU_SPI_MOSI, MCU_UART_CTS, MCU_UART_RTS, MCU_UART_RXD, MCU_UART_TXD, SPI1_CLK/GPIO_9, SPI1_CS/GPIO_10, SPI1_DIN/GPIO_12, SPI1_DIN/GPIO_12 (in), SPI1_DOUT/GPIO_11, UART1_CTS/GPIO_18, UART1_RTS/GPIO_19, UART1_RXD, UART1_TXD

### Nets
GND: C78.1 C79.2 J27.0 J28.0 J29.5 J30.5 U4.11(GND)
V_GLOBAL_1V8: C78.2 R19.2 R20.2 U4.2(VCCA) U4.10(OE)
VDD_MCU: C79.1 R23.2 U4.19(VCCB)
MCU_SPI_CLK: U4.14(B6) ; port MCU_SPI_CLK
MCU_SPI_CS: U4.15(B5) ; port MCU_SPI_CS
MCU_SPI_MISO: U4.13(B7) ; port MCU_SPI_MISO
MCU_SPI_MOSI: U4.12(B8) ; port MCU_SPI_MOSI
MCU_UART_CTS: U4.17(B3) ; port MCU_UART_CTS
MCU_UART_RTS: U4.16(B4) ; port MCU_UART_RTS
MCU_UART_RXD: U4.20(B1) ; port MCU_UART_RXD
MCU_UART_TXD: U4.18(B2) ; port MCU_UART_TXD
SPI1_CLK/GPIO_9: J33.2 U4.7(A6) ; port SPI1_CLK/GPIO_9
SPI1_CS/GPIO_10: J33.3 U4.6(A5) ; port SPI1_CS/GPIO_10
SPI1_DIN/GPIO_12: J33.1 U4.8(A7) ; port SPI1_DIN/GPIO_12
SPI1_DOUT/GPIO_11: J33.4 U4.9(A8) ; port SPI1_DOUT/GPIO_11
UART1_CTS/GPIO_18: U4.5(A4) ; port UART1_CTS/GPIO_18
UART1_RTS/GPIO_19: U4.4(A3) ; port UART1_RTS/GPIO_19
UART1_RXD: U4.3(A2) ; port UART1_RXD
UART1_TXD: U4.1(A1) ; port UART1_TXD
NetD2_1: D2.1 ; port $$$7258
NetD2_2: D2.2 R20.1 ; port $$$7257
NetJ27_1: J27.1 J28.1
NetJ27_2: J27.2 J28.2
NetJ29_1: J29.1 J30.1
NetJ29_2: J29.2 J30.2
NetJ29_3: J29.3 J30.3
NetJ29_4: J29.4 J30.4
NetQ4_1: Q4.1 ; port $$$7256
NetQ4_2: Q4.2 R19.1
NetQ4_3: Q4.3 R23.1 ; port $$$7259

### Notes on the sheet
- (near J27) DTE
- 三线制串口参考设计
- 串口电压转换参考设计
- (near J28) DCE
- (near J28) TXD
- (near J28) RXD
- (near J27) RXD
- (near J27) TXD
- (near J28) Module
- (near J28) GND
- (near J27) GND
- (near J27) MCU
- 模块的串口电压是1.8V，请注意串口的电平匹配。
- MCU
- Module
- RXD
- TXD
- 带流控串口参考设计
- (near J29) DCE
- (near J29) TXD
- (near J30) RXD
- (near J30) DTE
- (near J29) RXD
- (near J29) RTS
- (near J30) TXD
- (near J30) CTS
- (near Q4) V_GLOBAL_1V8是模块输出的I/O电平电压。VDD_MCU是客户端的I/O电平电压。
- (near J29) GND
- (near J29) CTS
- (near J30) RTS
- (near J30) GND
- D2 选低导通压降的肖特基二极管。
- 这个转换电路最多支持460800bps的波特率
- (near J29) Module
- 当发送大量数据时，CTS和RTS用于硬件流控。
- (near J30) MCU
- 超过460800bps的波特率需要外加电平转换芯片来实现电压转换。
- 电平转换芯片
- 1.UART1通常用来和模块进行AT指令通讯。支持自适应波特率
- 2.UART2 与内部的蓝牙串口复用，如果使用蓝牙功能，则UART2 会被占用。
- 电平转换芯片可以用TI的TXS0108E， 8 位双向电压电平转换器，适用于漏极开路和推挽应用
- 3.UART3 是一个通用串口，可以用作外接GPS等外设。
- 最大支持速率：
- 4.HOST UART 用来软件调试时输出AP trace
- 推挽：110Mbps
- 开漏：1.2Mbps
- 5.ZSP UART 用来软件调试时输出CP trace
- MODULE
- (near J33) 外围设备
- (near J33) SPI_MISO
- SPI的速率比较高，需要电平转换时也得用电平转换芯片
- (near J33) SPI_CLK
- (near J33) SPI_CS
- (near J33) SPI_MOSI
- TITLE:
- REV:
- 模块只支持SPI master 模式
- 模块的IO电压是1.8V，请注意电平匹配。
- DEPARTMENT:
- DOCUMENT NO.:
- Hardware DEPT.
- SIZED:
- COMPANY:
- AirM2M
- DESIGNER:
- Last Saved Date:
- SHEET:
- OF

### Library data of the parts
C78 C79 = CAP-1UF-0402-X5R: as C128 on sheet T-FLASH; Tolerance: +/-10%; PCB DECAL: SC0402
D2 = DIODE-SCHOTTKY-RB521S-30: Schottky Diode;30V;200mA/0.6V;SOD-523;0.7mm;ROHS; Manufacture 1: Panjit;WILL;KEC;Onsemi;; Manufacture 1 P/N: RB521S30T1G;KDR730E;RB521S30-2/TR;RB521S30/TR; Serial Number: 81210000004; Geometry.Height: 0.7mm; PCB DECAL: SOD523(RB521S)
J27 J28 = DIP3X1: Geometry.Height: 2mm; PCB DECAL: DIP2X1-2.54
J29 J30 = DIP5X1: Geometry.Height: 2mm; PCB DECAL: DIP2X1-2.54
J33 = DIP4X1: Geometry.Height: 2mm; PCB DECAL: DIP2X1-2.54
Q4 = TRIODE-NPN-2SC3356: Silicon RF Transistor;NPN;12V;0.1A;3-PIN;1.4mm;ROHS; Manufacture 1: NEC; serial number: 81232000003; Geometry.Height: 1.4mm; Manufacture 1 P/N: 2SC3356; PCB DECAL: 3PIN-2SC3356
R19 R20 R23 = RES-4.7K-0402: RES FILM;4.7K;+/-5%;1/16W;0402;0.4mm;ROHS; Manufacture 1 P/N: RC0402JR-074K7L; Manufacture 1: YAGEO; Serial Number: 80114640017; Geometry.Height: 0.4mm; Tolerance: +/-5%; PCB DECAL: SR0402
U4 = TXS0108EPW: TXS0108E 8 位双向电压电平转换器，适用于漏极开路和推挽应用; Manufacture 1: TI; Manufacture 1 P/N: TXS0108EPW